# EAGLE design metal_detector (EAGLE 9.3.0)
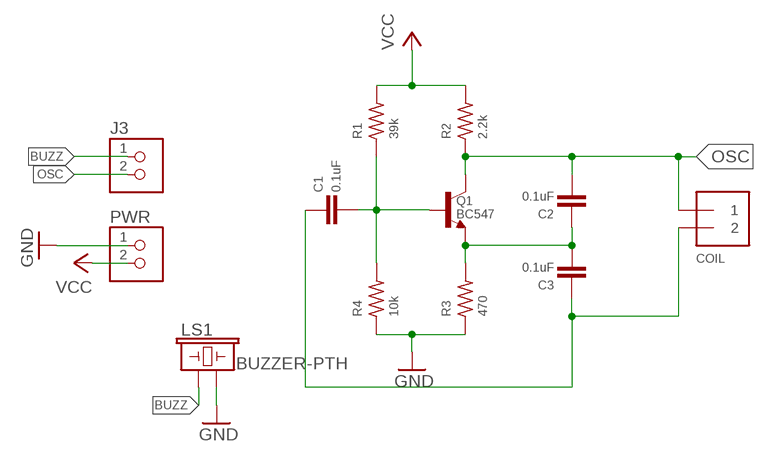
[diagram p0: schematic, sheet 1]

## Parts
C1  0.1uF  0.1UF-KIT-EZ-50V-20%  [CAP-PTH-SMALL-KIT]
C2  0.1uF  0.1UF-KIT-EZ-50V-20%  [CAP-PTH-SMALL-KIT]
C3  0.1uF  0.1UF-KIT-EZ-50V-20%  [CAP-PTH-SMALL-KIT]
COIL  TERMBLOCK_1X2  [TERMBLOCK_1X2-3.5MM]
J3  TERM-1X02-ADAFRUIT  [3.5MMTERM]
LS1  BUZZER-PTH  [BUZZER-12MM]
PWR  TERM-1X02-ADAFRUIT  [3.5MMTERM]
Q1  BC547  [TO92]
R1  39k  R-US_0207/10  [0207/10]
R2  2.2k  R-US_0207/10  [0207/10]
R3  470  R-US_0207/10  [0207/10]
R4  10k  R-US_0207/10  [0207/10]

## Nets
BUZZ: J3.1 LS1.+
GND: LS1.- PWR.1 R3.1 R4.1
N$2: C1.1 C3.1 COIL.2
N$3: C2.1 C3.2 Q1.1(E) R3.2
N$5: C1.2 Q1.2(B) R1.1 R4.2
OSC: C2.2 COIL.1 J3.2 Q1.3(C) R2.1
VCC: PWR.2 R1.2 R2.2

## Library data of the parts
C1-C3 = SparkFun-Capacitors:0.1UF: 0.1µF ceramic capacitors A capacitor is a passive two-terminal electrical component used to store electrical energy temporarily in an electric field.; PROD_ID: CAP-08370
COIL = microbuilder:TERMBLOCK_1X2: 3.5mm Terminal block http://www.ladyada.net/library/pcb/eaglelibrary.html
J3 PWR = fab:TERM-1X02: 3.5mm terminal block, 2 positions ED555-2DS as found in the fablab inventory. Stolen from Adafruit <http://www.ladyada.net/library/pcb/eaglelibrary.html>, adapted by Zaerc.
LS1 = SparkFun-Electromechanical:BUZZER: Buzzer Small round buzzers that operate around the audible 2kHz range. You can use these as speakers to create simple music or user interfaces. Variant Overview: PTH - Mini Speaker - PC Mount 12mm 2.048kHz <https://www.sparkfun.com/products/7950> PTH_KIT - Mini Speaker - PC Mount 12mm 2.048kHz <https://www.sparkfun.com/products/7950> KIT simplifies soldering by adding stop mask to one side of the pads. PTH_NO_SILK - Mini Speaker - PC Mount 12mm 2.048kHz <https://www.sparkfun.com/products/7950> No silkscreen indicator of buzzer outline. PTH_KIT_NO_SILK - Mini Speaker - PC Mount 12mm 2.048kHz <https://www.sparkfun.com/products/7950> KIT package w/o silkscreen SMD - Buzzer Audio Magnetic (CCV-084B16) SMD buzzer used on, e.g. the LilyPad Buzzer <https://www.sparkfun.com/products/8463> and RFID USB Reader <https://www.sparkfun.com/products/9963>. SMD_KIT - Buzzer Audio Magnetic (CCV-084B16) SMD Buzzer with elongated pins to make soldering easier. Used on the SparkFun Simon Says - Surface Mount Soldering Kit <https://www.sparkfun.com/products/10935>.; PROD_ID: COMP-08253; SF_SKU: COM-07950
Q1 = transistor:BC547: NPN TRANSISTOR
R1-R4 = adafruit:R-US_: RESISTOR, American symbol

## Board
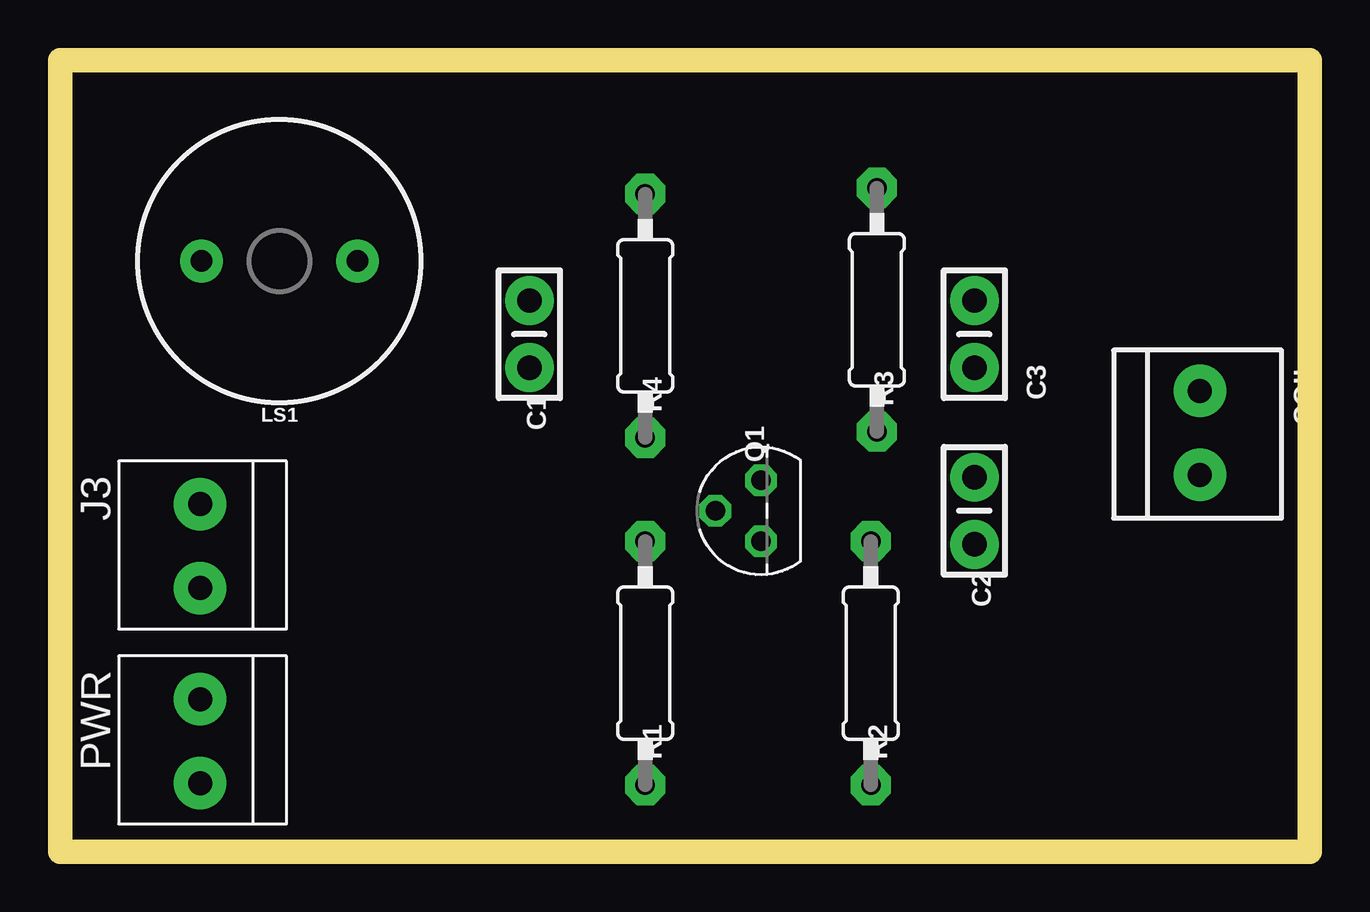
[diagram p1: board, top side]
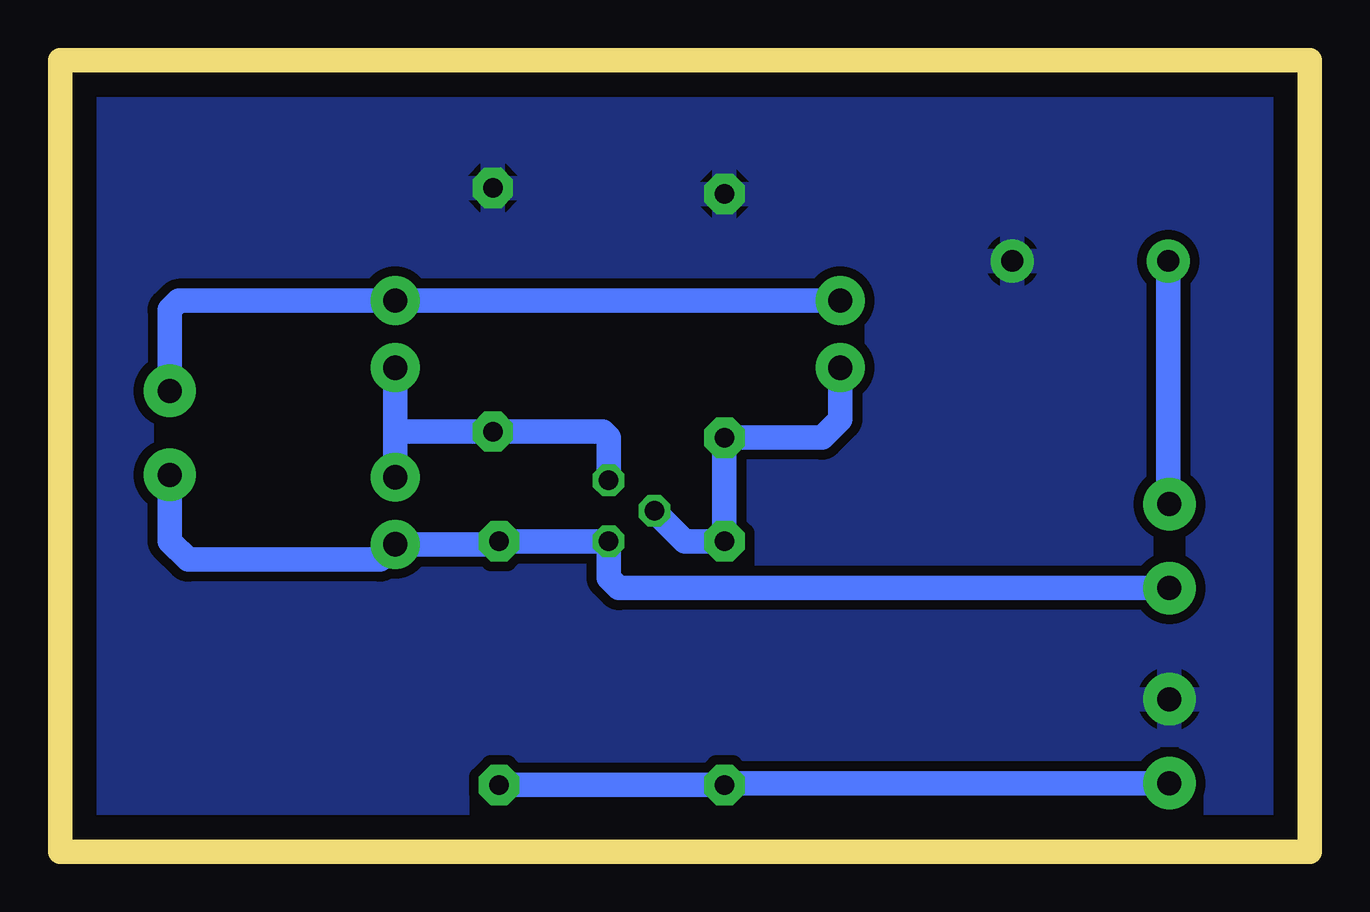
[diagram p2: board, bottom side, seen from below]

Size 52.07 x 33.02 mm. Coordinates in mm from the lower left corner, seen from the top.
Outline: 0,0 52.07,0 52.07,33.02 0,33.02 0,0
Copper layers (1*16): Top 0.035mm / dielectric 1.5mm / Bottom 0.035mm
Design rules "default *": minimum track width 20mil, minimum drill 0.35mm, track to track 12mil, track to pad 12mil, pad to pad 12mil, via to via 12mil, smd to smd 6mil, copper to edge 40mil, drill to drill 6mil, minimum pad ring 10mil, minimum via ring 8mil, stop-mask expansion 4mil, vias tented up to drill 0mil, thermal gap 10mil

### Footprints (pad centres in the part's own frame; a part is rotated, then mirrored left to right if it is on the bottom)
CAP-PTH-SMALL-KIT = drill 1.016 pad 2.032: 1 -1.397,0; 2 1.397,0
TERMBLOCK_1X2-3.5MM = drill 1 pad 2.184: 1 1.8,0; 2 -1.7,0
3.5MMTERM = drill 1 pad 2.184: 1 1.8,0; 2 -1.7,0
BUZZER-12MM = drill 0.9 pad 1.778: + 3.25,0; - -3.25,0
TO92 = drill 0.813 octagon: 1 1.27,0; 2 0,1.905; 3 -1.27,0
0207/10 = drill 0.813 pad 1.676 octagon: 1 -5.08,0; 2 5.08,0

### Placement (x,y rotation side)
C1  19.56,21.59 270 top
C2  38.1,14.22 270 top
C3  38.1,21.59 270 top
COIL  47.5,17.53 270 top
J3  5.84,12.7 90 top
LS1  9.14,24.64 180 top
PWR  5.84,4.57 90 top
Q1  29.21,14.22 90 top
R1  24.38,7.87 270 top
R2  33.78,7.87 270 top
R3  34.04,22.61 270 top
R4  24.38,22.35 270 top

### Tracks (layer width: path | path; a pad name or v marks a point on that pad's centre or on a via)
BUZZ
  Bottom 1.016: LS1.+ 5.89,14.55 J3.1
GND
  pour Bottom (isolate 0.406): 0,0.25 0,33.27 52.07,33.27 52.07,1.52 52.07,0.25
N$2
  Bottom 1.016: C1.1 C3.1 47.12,22.99 47.5,22.61 COIL.2
N$3
  Bottom 1.016: Q1.1 29.21,17.27 29.46,17.53 R3.2 38.1,17.53 | C2.1 38.1,17.53 | 38.1,17.53 C3.2
N$5
  Bottom 1.016: C1.2 19.56,18.03 20.32,17.27 R4.2 R1.1 26.04,12.95 Q1.2
OSC
  Bottom 1.016: COIL.1 47.5,12.95 46.74,12.19 38.73,12.19 C2.2 33.91,12.83 R2.1 Q1.3 29.21,11.43 28.78,11 J3.2
VCC
  Bottom 1.016: PWR.2 24.31,2.87 R1.2 R2.2